# Altium schematic sheet Pair 2.SchDoc
size B
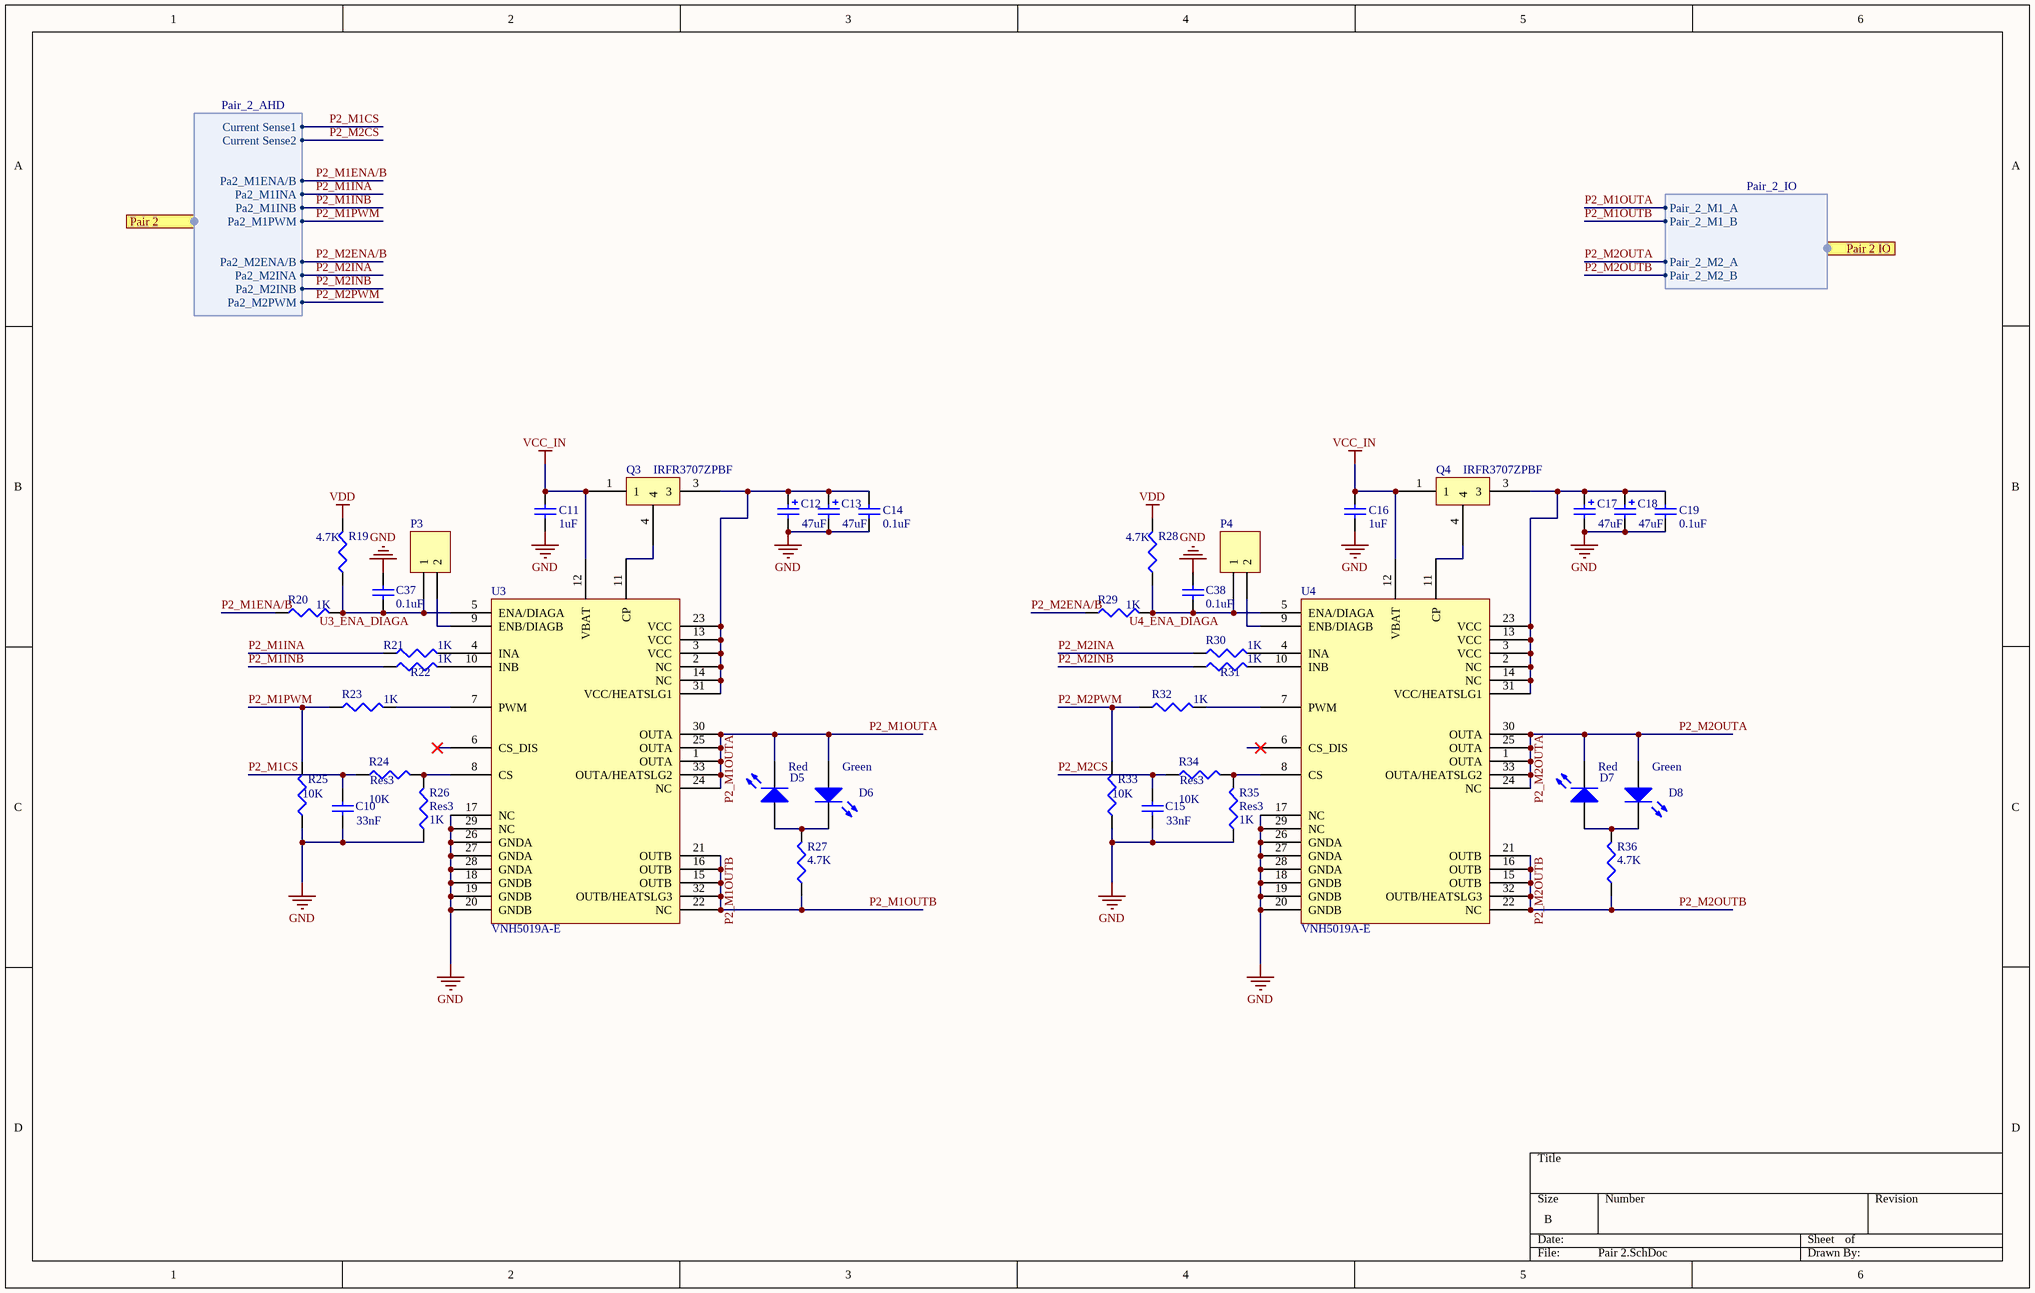
[diagram p0: Pair 2.SchDoc]

## Parts
C10  value 33nF  [1608[0603]]  (hidden comment: Cap Semi)
C11  value 1uF  [1608[0603]]  (hidden comment: Cap Semi)
C12  value 47uF  [CAPPR2-5x6.8]  (hidden comment: Cap Pol2)
C13  value 47uF  [CAPPR2-5x6.8]  (hidden comment: Cap Pol2)
C14  value 0.1uF  [C1206]  (hidden comment: Cap Semi)
C15  value 33nF  [1608[0603]]  (hidden comment: Cap Semi)
C16  value 1uF  [1608[0603]]  (hidden comment: Cap Semi)
C17  value 47uF  [CAPPR2-5x6.8]  (hidden comment: Cap Pol2)
C18  value 47uF  [CAPPR2-5x6.8]  (hidden comment: Cap Pol2)
C19  value 0.1uF  [C1206]  (hidden comment: Cap Semi)
C37  value 0.1uF  [1608[0603]]  (hidden comment: Cap Semi)
C38  value 0.1uF  [1608[0603]]  (hidden comment: Cap Semi)
D5  LED2  [3.2X1.6X1.1]  (value not drawn)
D6  LED2  [3.2X1.6X1.1]  (value not drawn)
D7  LED2  [3.2X1.6X1.1]  (value not drawn)
D8  LED2  [3.2X1.6X1.1]  (value not drawn)
P3  Header 2  [HDR1X2]  (value not drawn)
P4  Header 2  [HDR1X2]  (value not drawn)
Q3  IRFR3707ZPBF  [IRFR3707ZPBF]
Q4  IRFR3707ZPBF  [IRFR3707ZPBF]
R19  value 4.7K  [RESC1608L]  (hidden comment: Res3)
R20  value 1K  [RESC1608L]  (hidden comment: Res3)
R21  value 1K  [RESC1608L]  (hidden comment: Res3)
R22  value 1K  [RESC1608L]  (hidden comment: Res3)
R23  value 1K  [RESC1608L]  (hidden comment: Res3)
R24  Res3  value 10K  [RESC1608L]
R25  value 10K  [RESC1608L]  (hidden comment: Res3)
R26  Res3  value 1K  [RESC1608L]
R27  value 4.7K  [0805 SMD Resistor]  (hidden comment: Res3)
R28  value 4.7K  [RESC1608L]  (hidden comment: Res3)
R29  value 1K  [RESC1608L]  (hidden comment: Res3)
R30  value 1K  [RESC1608L]  (hidden comment: Res3)
R31  value 1K  [RESC1608L]  (hidden comment: Res3)
R32  value 1K  [RESC1608L]  (hidden comment: Res3)
R33  value 10K  [RESC1608L]  (hidden comment: Res3)
R34  Res3  value 10K  [RESC1608L]
R35  Res3  value 1K  [RESC1608L]
R36  value 4.7K  [0805 SMD Resistor]  (hidden comment: Res3)
U3  VNH5019A-E  [VNH5019A-E]
U4  VNH5019A-E  [VNH5019A-E]

## Ports
Pair 2 (harness Pair_2_AHD), Pair 2 IO (harness Pair_2_IO)

## Harnesses
Pair_2_IO: Pair_2_M1_A, Pair_2_M1_B, Pair_2_M2_A, Pair_2_M2_B
Pair_2_AHD: Current Sense1, Current Sense2, Pa2_M1ENA/B, Pa2_M1INA, Pa2_M1INB, Pa2_M1PWM, Pa2_M2INA, Pa2_M2ENA/B, Pa2_M2INB, Pa2_M2PWM

## Nets
GND: C10.1 C11.1 C12.2 C13.2 C14.1 C15.1 C16.1 C17.2 C18.2 C19.1 C37.1 C38.1 R25.1 R26.1 R33.1 R35.1 U3.17(NC) U3.18(GNDB) U3.19(GNDB) U3.20(GNDB) U3.26(GNDA) U3.27(GNDA) U3.28(GNDA) U3.29(NC) U4.17(NC) U4.18(GNDB) U4.19(GNDB) U4.20(GNDB) U4.26(GNDA) U4.27(GNDA) U4.28(GNDA) U4.29(NC)
VCC_IN: C11.2 C16.2 Q3.1 Q4.1 U3.12(VBAT) U4.12(VBAT)
VDD: R19.2 R28.2
P2_M1CS: C10.2 R24.1 ; port Pair 2.Current Sense1
P2_M1ENA/B: R20.1 ; port Pair 2.Pa2_M1ENA/B
P2_M1INA: R21.1 ; port Pair 2.Pa2_M1INA
P2_M1INB: R22.1 ; port Pair 2.Pa2_M1INB
P2_M1OUTA: D5.2(K) D6.1(A) U3.1(OUTA) U3.24(NC) U3.25(OUTA) U3.30(OUTA) U3.33(OUTA/HEATSLG2) ; port Pair 2 IO.Pair_2_M1_A
P2_M1OUTB: R27.1 U3.15(OUTB) U3.16(OUTB) U3.21(OUTB) U3.22(NC) U3.32(OUTB/HEATSLG3) ; port Pair 2 IO.Pair_2_M1_B
P2_M1PWM: R23.1 R25.2 ; port Pair 2.Pa2_M1PWM
P2_M2CS: C15.2 R34.1 ; port Pair 2.Current Sense2
P2_M2ENA/B: R29.1 ; port Pair 2.Pa2_M2ENA/B
P2_M2INA: R30.1 ; port Pair 2.Pa2_M2INA
P2_M2INB: R31.1 ; port Pair 2.Pa2_M2INB
P2_M2OUTA: D7.2(K) D8.1(A) U4.1(OUTA) U4.24(NC) U4.25(OUTA) U4.30(OUTA) U4.33(OUTA/HEATSLG2) ; port Pair 2 IO.Pair_2_M2_A
P2_M2OUTB: R36.1 U4.15(OUTB) U4.16(OUTB) U4.21(OUTB) U4.22(NC) U4.32(OUTB/HEATSLG3) ; port Pair 2 IO.Pair_2_M2_B
P2_M2PWM: R32.1 R33.2 ; port Pair 2.Pa2_M2PWM
U3_ENA_DIAGA: C37.2 P3.1 R19.1 R20.2 U3.5(ENA/DIAGA)
U4_ENA_DIAGA: C38.2 P4.1 R28.1 R29.2 U4.5(ENA/DIAGA)
NetC12_1: C12.1 C13.1 C14.2 Q3.3 U3.2(NC) U3.3(VCC) U3.13(VCC) U3.14(NC) U3.23(VCC) U3.31(VCC/HEATSLG1)
NetC17_1: C17.1 C18.1 C19.2 Q4.3 U4.2(NC) U4.3(VCC) U4.13(VCC) U4.14(NC) U4.23(VCC) U4.31(VCC/HEATSLG1)
NetD5_1: D5.1(A) D6.2(K) R27.2
NetD7_1: D7.1(A) D8.2(K) R36.2
NetP3_2: P3.2 U3.9(ENB/DIAGB)
NetP4_2: P4.2 U4.9(ENB/DIAGB)
NetQ3_4: Q3.4 U3.11(CP)
NetQ4_4: Q4.4 U4.11(CP)
NetR21_2: R21.2 U3.4(INA)
NetR22_2: R22.2 U3.10(INB)
NetR23_2: R23.2 U3.7(PWM)
NetR24_2: R24.2 R26.2 U3.8(CS)
NetR30_2: R30.2 U4.4(INA)
NetR31_2: R31.2 U4.10(INB)
NetR32_2: R32.2 U4.7(PWM)
NetR34_2: R34.2 R35.2 U4.8(CS)

Not connected (* = marked no-connect by the designer): U3 6(CS_DIS)*; U4 6(CS_DIS)*

## Notes on the sheet
- Red
- (near D6) Green
- (near D8) Green

## Library data of the parts
C10 C11 C14-C16 C19 C37 C38 = Cap Semi: Capacitor (Semiconductor SIM Model); Published: 8-Jun-2000; LatestRevisionDate: 29-May-2009; LatestRevisionNote: IPC-7351 Footprint Added.; PackageReference: C1206; Publisher: Altium Limited; PackageDescription: Chip Capacitor
C12 C13 C17 C18 = Cap Pol2: Polarized Capacitor (Axial); Published: 8-Jun-2000; LatestRevisionDate: 17-Jul-2002; LatestRevisionNote: Re-released for DXP Platform.; PackageReference: POLAR0.8; Publisher: Altium Limited; PackageDescription: Polarized Capacitor; 2 Leads
D5-D8 = LED2: Typical RED, GREEN, YELLOW, AMBER GaAs LED; Published: 8-Jun-2000; LatestRevisionDate: 17-Jul-2002; LatestRevisionNote: Re-released for DXP Platform.; PackageVersion: Feb-2002; PackageReference: 3.2X1.6X1.1; Publisher: Altium Limited; PackageDescription: SM LED; 2 Flat Leads
P3 P4 = Header 2: Header, 2-Pin; LatestRevisionDate: 17-Jul-2002; LatestRevisionNote: Re-released for DXP Platform.; Publisher: Altium Limited
Q3 Q4 = IRFR3707ZPBF: Power FET
R19-R36 = Res3: Resistor; Published: 8-Jun-2000; LatestRevisionDate: 29-May-2009; LatestRevisionNote: IPC-7351 Footprint Added.; PackageReference: J1-0603; Publisher: Altium Limited; PackageDescription: Chip Resistor
U3 U4 = VNH5019A-E: VNH5019A-E H-Bridge